# Altium schematic sheet LPDDR4.SchDoc
size Tabloid; SheetNumber: 5; SheetTotal: 11
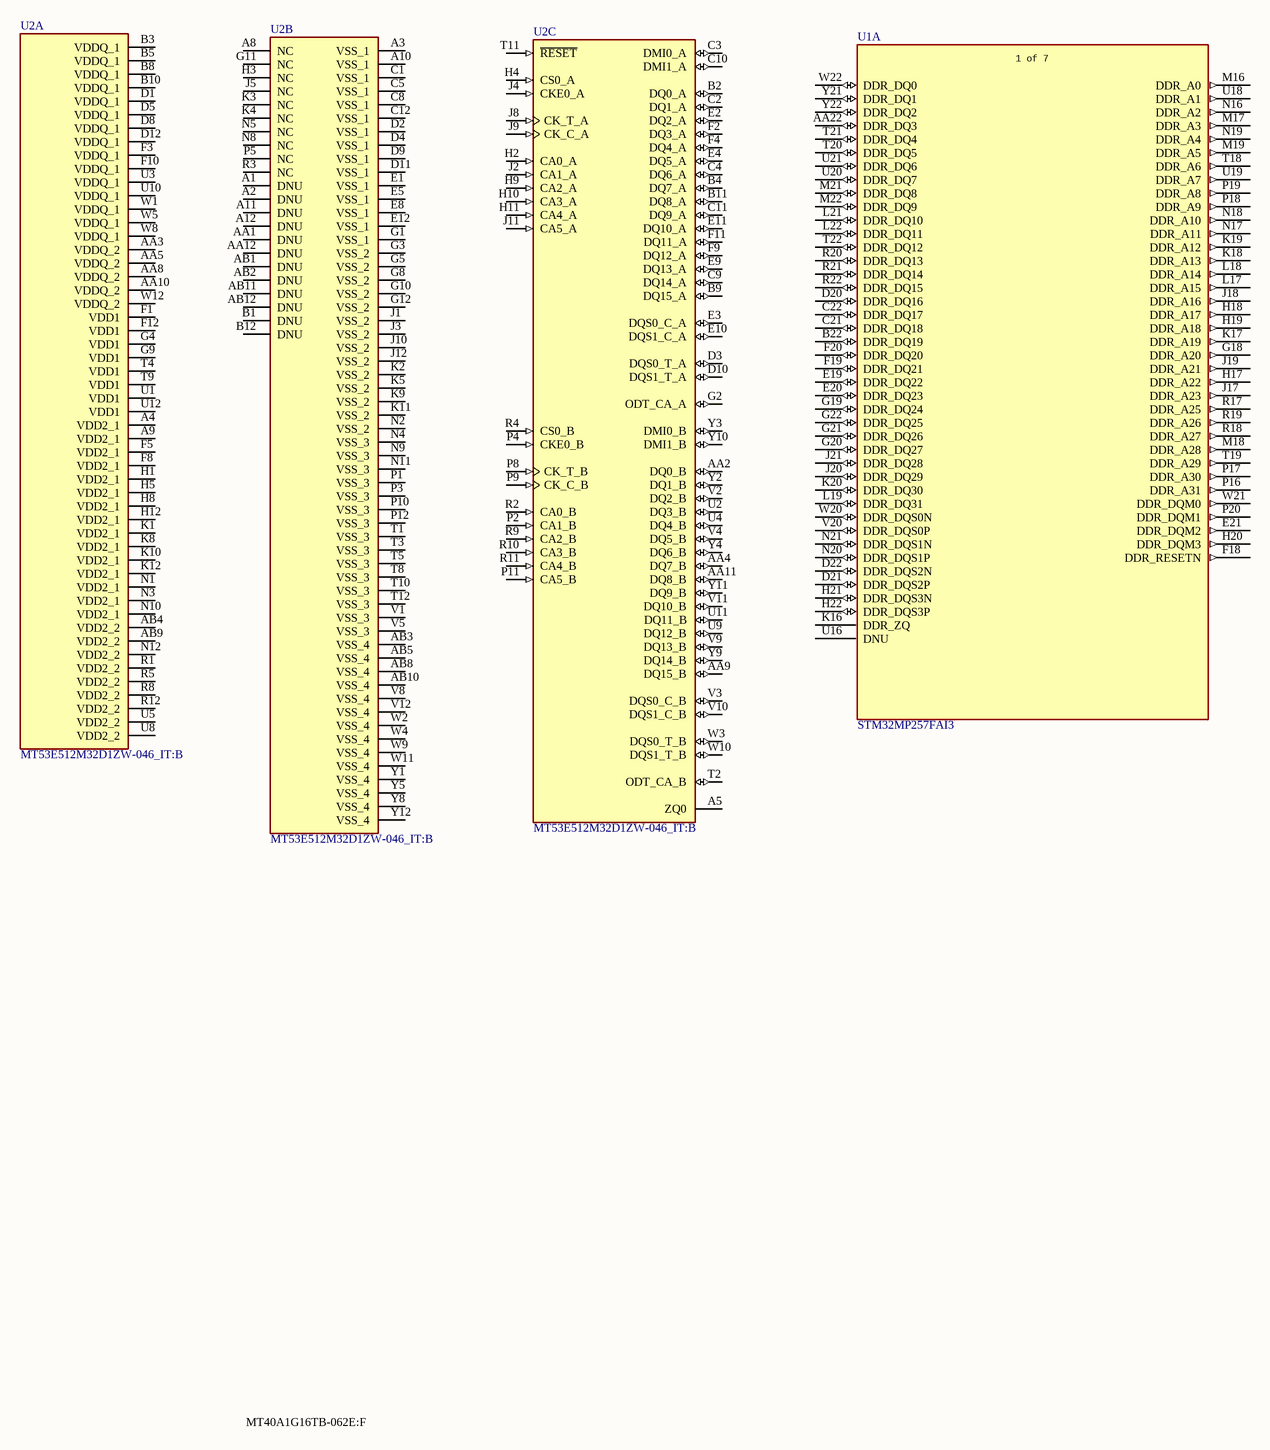
[diagram p0: LPDDR4.SchDoc]

## Parts
U1  STM32MP257FAI3  [TFBGA436_STM]  (part A of 8)
U2  MT53E512M32D1ZW-046_IT:B  [BGA200C65P12X22_1000X1450X105]  (parts A,B,C of 3)

## Nets

Not connected (* = marked no-connect by the designer): U1 AA22(DDR_DQ3) B22(DDR_DQ19) C21(DDR_DQ18) C22(DDR_DQ17) D20(DDR_DQ16) D21(DDR_DQS2P) D22(DDR_DQS2N) E19(DDR_DQ22) E20(DDR_DQ23) E21(DDR_DQM2) F18(DDR_RESETN) F19(DDR_DQ21) F20(DDR_DQ20) G18(DDR_A20) G19(DDR_DQ24) G20(DDR_DQ27) G21(DDR_DQ26) G22(DDR_DQ25) H17(DDR_A22) H18(DDR_A17) H19(DDR_A18) H20(DDR_DQM3) H21(DDR_DQS3N) H22(DDR_DQS3P) J17(DDR_A23) J18(DDR_A16) J19(DDR_A21) J20(DDR_DQ29) J21(DDR_DQ28) K16(DDR_ZQ) K17(DDR_A19) K18(DDR_A13) K19(DDR_A12) K20(DDR_DQ30) L17(DDR_A15) L18(DDR_A14) L19(DDR_DQ31) L21(DDR_DQ10) L22(DDR_DQ11) M16(DDR_A0) M17(DDR_A3) M18(DDR_A28) M19(DDR_A5) M21(DDR_DQ8) M22(DDR_DQ9) N16(DDR_A2) N17(DDR_A11) N18(DDR_A10) N19(DDR_A4) N20(DDR_DQS1P) N21(DDR_DQS1N) P16(DDR_A31) P17(DDR_A30) P18(DDR_A9) P19(DDR_A8) P20(DDR_DQM1) R17(DDR_A25) R18(DDR_A27) R19(DDR_A26) R20(DDR_DQ13) R21(DDR_DQ14) R22(DDR_DQ15) T18(DDR_A6) T19(DDR_A29) T20(DDR_DQ5) T21(DDR_DQ4) T22(DDR_DQ12) U16(DNU) U18(DDR_A1) U19(DDR_A7) U20(DDR_DQ7) U21(DDR_DQ6) V20(DDR_DQS0P) W20(DDR_DQS0N) W21(DDR_DQM0) W22(DDR_DQ0) Y21(DDR_DQ1) Y22(DDR_DQ2); U2 A1(DNU) A2(DNU) A3(VSS_1) A4(VDD2_1) A5(ZQ0) A8(NC) A9(VDD2_1) A10(VSS_1) A11(DNU) A12(DNU) AA1(DNU) AA2(DQ0_B) AA3(VDDQ_2) AA4(DQ7_B) AA5(VDDQ_2) AA8(VDDQ_2) AA9(DQ15_B) AA10(VDDQ_2) AA11(DQ8_B) AA12(DNU) AB1(DNU) AB2(DNU) AB3(VSS_4) AB4(VDD2_2) AB5(VSS_4) AB8(VSS_4) AB9(VDD2_2) AB10(VSS_4) AB11(DNU) AB12(DNU) B1(DNU) B2(DQ0_A) B3(VDDQ_1) B4(DQ7_A) B5(VDDQ_1) B8(VDDQ_1) B9(DQ15_A) B10(VDDQ_1) B11(DQ8_A) B12(DNU) C1(VSS_1) C2(DQ1_A) C3(DMI0_A) C4(DQ6_A) C5(VSS_1) C8(VSS_1) C9(DQ14_A) C10(DMI1_A) C11(DQ9_A) C12(VSS_1) D1(VDDQ_1) D2(VSS_1) D3(DQS0_T_A) D4(VSS_1) D5(VDDQ_1) D8(VDDQ_1) D9(VSS_1) D10(DQS1_T_A) D11(VSS_1) D12(VDDQ_1) E1(VSS_1) E2(DQ2_A) E3(DQS0_C_A) E4(DQ5_A) E5(VSS_1) E8(VSS_1) E9(DQ13_A) E10(DQS1_C_A) E11(DQ10_A) E12(VSS_1) F1(VDD1) F2(DQ3_A) F3(VDDQ_1) F4(DQ4_A) F5(VDD2_1) F8(VDD2_1) F9(DQ12_A) F10(VDDQ_1) F11(DQ11_A) F12(VDD1) G1(VSS_1) G2(ODT_CA_A) G3(VSS_2) G4(VDD1) G5(VSS_2) G8(VSS_2) G9(VDD1) G10(VSS_2) G11(NC) G12(VSS_2) H1(VDD2_1) H2(CA0_A) H3(NC) H4(CS0_A) H5(VDD2_1) H8(VDD2_1) H9(CA2_A) H10(CA3_A) H11(CA4_A) H12(VDD2_1) J1(VSS_2) J2(CA1_A) J3(VSS_2) J4(CKE0_A) J5(NC) J8(CK_T_A) J9(CK_C_A) J10(VSS_2) J11(CA5_A) J12(VSS_2) K1(VDD2_1) K2(VSS_2) K3(NC) K4(NC) K5(VSS_2) K8(VDD2_1) K9(VSS_2) K10(VDD2_1) K11(VSS_2) K12(VDD2_1) N1(VDD2_1) N2(VSS_2) N3(VDD2_1) N4(VSS_3) N5(NC) N8(NC) N9(VSS_3) N10(VDD2_1) N11(VSS_3) N12(VDD2_2) P1(VSS_3) P2(CA1_B) P3(VSS_3) P4(CKE0_B) P5(NC) P8(CK_T_B) P9(CK_C_B) P10(VSS_3) P11(CA5_B) P12(VSS_3) R1(VDD2_2) R2(CA0_B) R3(NC) R4(CS0_B) R5(VDD2_2) R8(VDD2_2) R9(CA2_B) R10(CA3_B) R11(CA4_B) R12(VDD2_2) T1(VSS_3) T2(ODT_CA_B) T3(VSS_3) T4(VDD1) T5(VSS_3) T8(VSS_3) T9(VDD1) T10(VSS_3) T11(~{RESET}) T12(VSS_3) U1(VDD1) U2(DQ3_B) U3(VDDQ_1) U4(DQ4_B) U5(VDD2_2) U8(VDD2_2) U9(DQ12_B) U10(VDDQ_1) U11(DQ11_B) U12(VDD1) V1(VSS_3) V2(DQ2_B) V3(DQS0_C_B) V4(DQ5_B) V5(VSS_3) V8(VSS_4) V9(DQ13_B) V10(DQS1_C_B) V11(DQ10_B) V12(VSS_4) W1(VDDQ_1) W2(VSS_4) W3(DQS0_T_B) W4(VSS_4) W5(VDDQ_1) W8(VDDQ_1) W9(VSS_4) W10(DQS1_T_B) W11(VSS_4) W12(VDDQ_2) Y1(VSS_4) Y2(DQ1_B) Y3(DMI0_B) Y4(DQ6_B) Y5(VSS_4) Y8(VSS_4) Y9(DQ14_B) Y10(DMI1_B) Y11(DQ9_B) Y12(VSS_4)

## Notes on the sheet
- MT40A1G16TB-062E:F
- (in symbol STM32MP257FAI3, part A) 1 of 7

## Library data of the parts
U1 = STM32MP257FAI3: MPU with Dual Arm Cortex-A35 @1.5GHz, Cortex-M33 @400MHz, 3xEthernet (2+1 switch), 3xFD-CAN, LVDS/DSI, H.264, 3D GPU, AI/NN, Secure Boot, Cryptography, DRAM enc/dec, PKA; Manufacturer_Name: STMicroelectronics; Copyright: Copyright (C) 2025 Ultra Librarian. All rights reserved.; Manufacturer_Part_Number: STM32MP257FAI3; RefDes: RefDes; Type: Type
U2 = MT53E512M32D1ZW-046_IT:B: SDRAM - Mobile LPDDR4 Memory IC 16Gbit Parallel 2.133 GHz 3.5 ns 200-TFBGA (10x14.5); MF: Micron Technology; MP: MT53E512M32D1ZW-046 IT:B; SnapEDA_Link: https://www.snapeda.com/parts/MT53E512M32D1ZW-046%20IT:B/Micron/view-part/?ref=snap; Package: None; Value: *; Check_prices: https://www.snapeda.com/parts/MT53E512M32D1ZW-046%20IT:B/Micron/view-part/?ref=eda